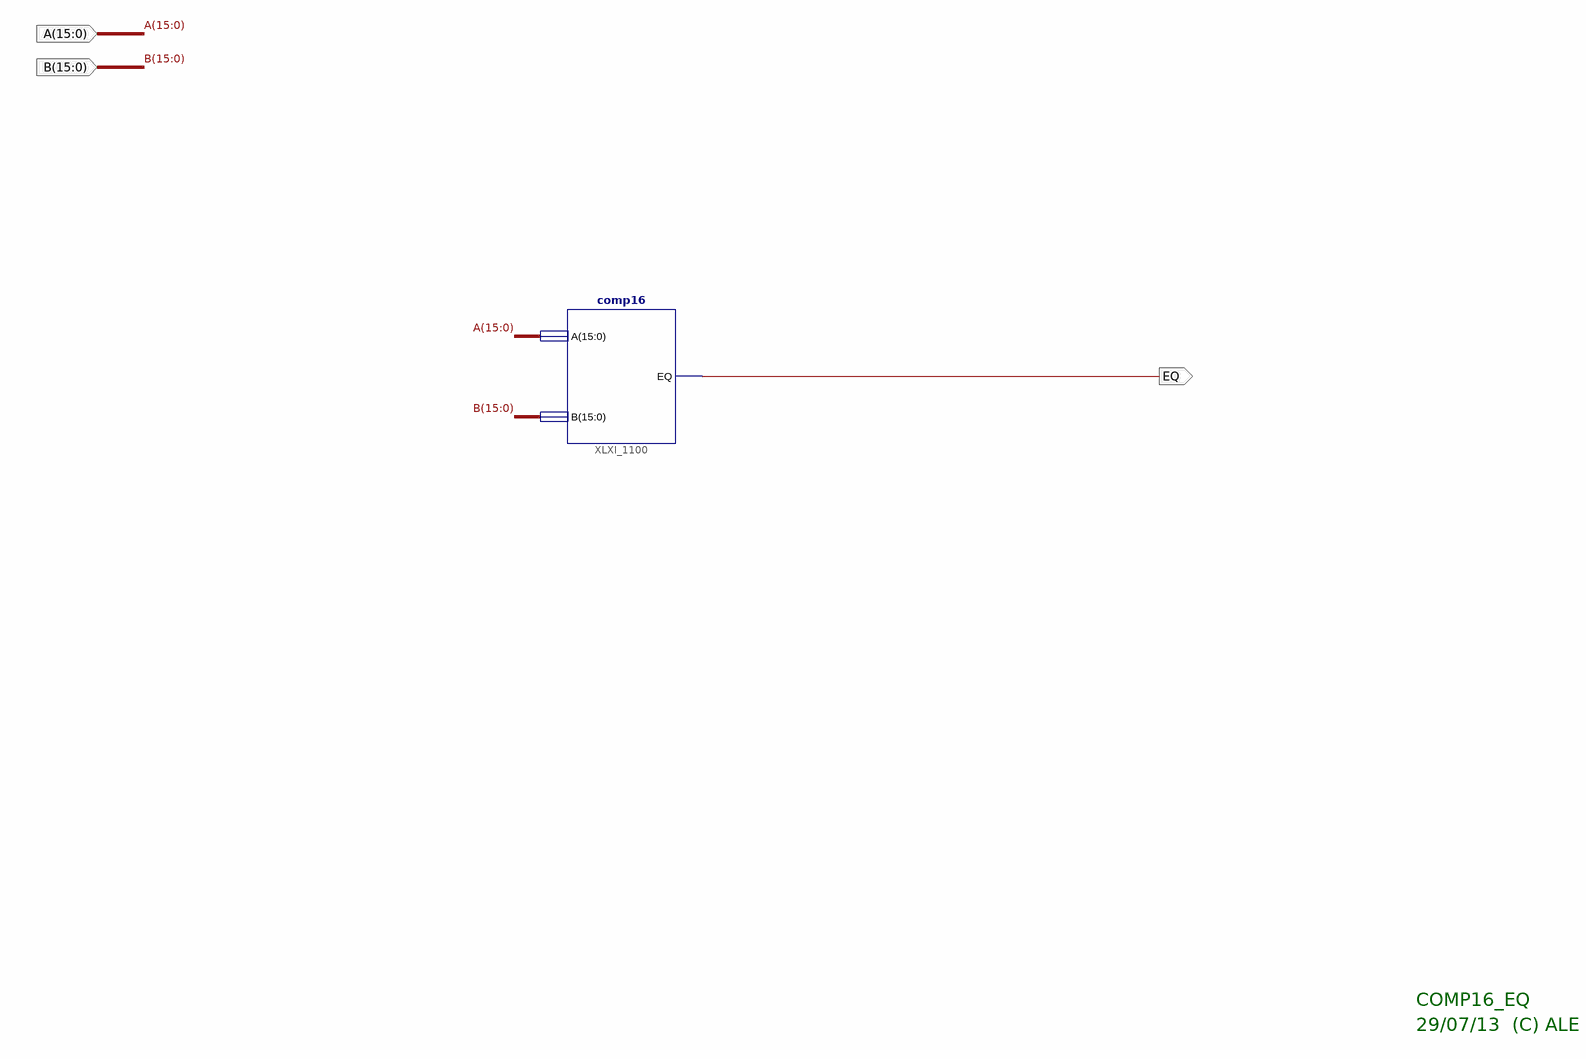
[diagram p0: schematic sheet 1]
// Xilinx ISE schematic DB_Comp16_eq.sch (spartan3e) as structural Verilog: 1 symbols, 3 ports
module DB_Comp16_eq (
  input  [15:0] A,
  input  [15:0] B,
  output EQ
);

  comp16 XLXI_1100 (.A(A), .B(B), .EQ(EQ));

  // Notes on the sheet:
  //   COMP16_EQ
  //   29/07/13  (C) ALE
endmodule
